# Altium schematic sheet RF.SchDoc
size A
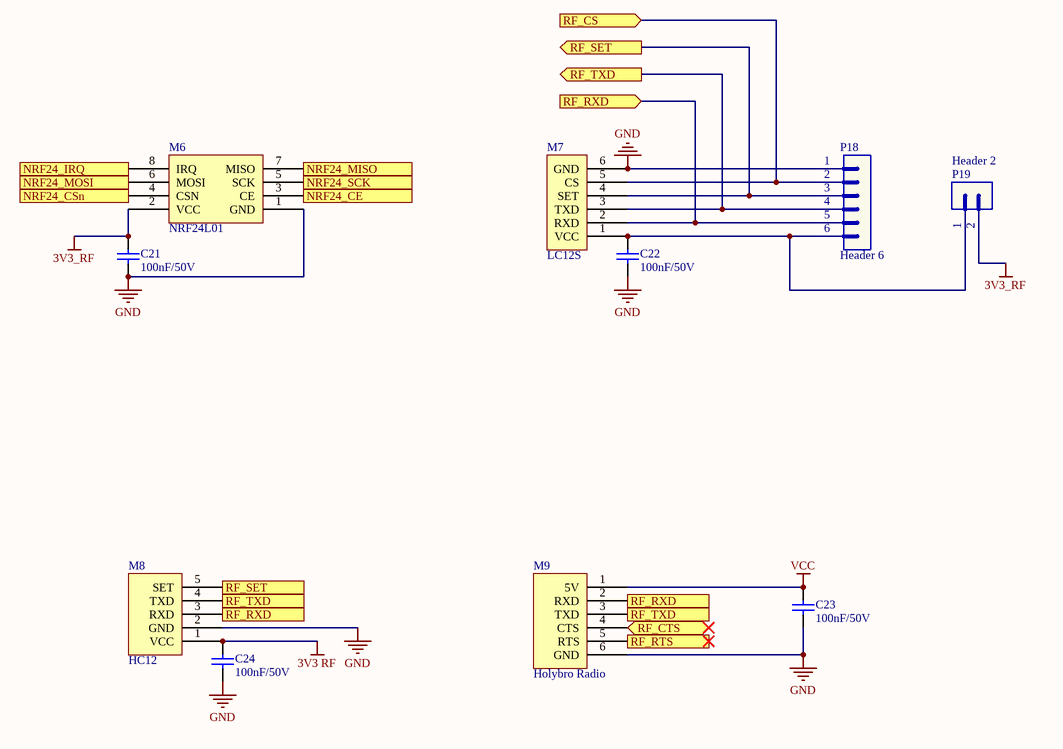
[diagram p0: RF.SchDoc]

## Parts
C21  value 100nF/50V  [CAP-SM-0805]  (hidden comment: Cap-100nF-50V-0805)
C22  value 100nF/50V  [CAP-SM-0805]  (hidden comment: Cap-100nF-50V-0805)
C23  value 100nF/50V  [CAP-SM-0805]  (hidden comment: Cap-100nF-50V-0805)
C24  value 100nF/50V  [CAP-SM-0805]  (hidden comment: Cap-100nF-50V-0805)
M6  NRF24L01  [NRF24L01]
M7  LC12S  [LC12S]
M8  HC12  [HC12]
M9  Holybro Radio  [HOLYBRO RADIO]
P18  Header 6  [JP6]
P19  Header 2  [JP2]

## Ports
NRF24_CE (in), NRF24_CSn (in), NRF24_IRQ (out), NRF24_MISO (out), NRF24_MOSI (in), NRF24_SCK (in), RF_CS (in), RF_CTS (bidir), RF_RTS, RF_RXD (in), RF_RXD (out), RF_SET (out), RF_TXD (in), RF_TXD (out)

## Nets
3V3 RF: C24.2 M8.1(VCC)
3V3_RF: C21.2 M6.2(VCC) P19.2
GND: C21.1 C22.1 C23.1 C24.1 M6.1(GND) M7.6(GND) M8.2(GND) M9.6(GND) P18.1
VCC: C23.2 M9.1(5V)
NRF24_CE: M6.3(CE) ; port NRF24_CE
NRF24_CSn: M6.4(CSN) ; port NRF24_CSn
NRF24_IRQ: M6.8(IRQ) ; port NRF24_IRQ
NRF24_MISO: M6.7(MISO) ; port NRF24_MISO
NRF24_MOSI: M6.6(MOSI) ; port NRF24_MOSI
NRF24_SCK: M6.5(SCK) ; port NRF24_SCK
RF_CS: M7.5(CS) P18.2 ; port RF_CS
RF_CTS: M9.4(CTS) ; port RF_CTS
RF_RTS: M9.5(RTS) ; port RF_RTS
RF_RXD: M7.2(RXD) M8.3(RXD) M9.2(RXD) P18.5 ; port RF_RXD
RF_SET: M7.4(SET) M8.5(SET) P18.3 ; port RF_SET
RF_TXD: M7.3(TXD) M8.4(TXD) M9.3(TXD) P18.4 ; port RF_TXD
NetC22_2: C22.2 M7.1(VCC) P18.6 P19.1

## Library data of the parts
C21-C24 = Cap-100nF-50V-0805: CAP CER 0.1UF 50V Y5V 0805; Manufacturer: Samsung Electro-Mechanics; Manufacturer Part Number: CL21F104ZBCNNNC; Local Supplier: thegioiic; Local Supplier Link: https://thegioiic.com/products/tu-100nf-0-1uf-50v-0805; Supplier 1: Digikey; Supplier 1 Part Number: 1276-1007-1-ND; Supplier 1 Link: https://www.digikey.com/product-detail/en/samsung-electro-mechanics/CL21F104ZBCNNNC/1276-1007-1-ND/3889093
P18 = Header 6: Header, 6-Pin; LatestRevisionDate: 17-Jul-2002; LatestRevisionNote: Re-released for DXP Platform.; Publisher: Altium Limited
P19 = Header 2: Header, 2-Pin; LatestRevisionDate: 17-Jul-2002; LatestRevisionNote: Re-released for DXP Platform.; Publisher: Altium Limited
M6 = NRF24L01: Local Supplier Link: https://hshop.vn/products/mach-thu-phat-nrf24l01-pa-2-4ghzcu-khech-dai-cung-suat-thu-phat; Local Supplier Part Number: HS000888; Manufacturer: *; Manufacturer Part Number: *; Local Supplier: HShop
M7 = LC12S: Local Supplier: HShop; Local Supplier Link: https://hshop.vn/products/mach-thu-phat-rf-uart-lc12s-2-4ghz; Local Supplier Part Number: HS000895; Manufacturer: *; Manufacturer Part Number: *
M8 = HC12: Local Supplier Link: https://hshop.vn/products/mach-thu-phat-rf-uart-si4463-433mhzkhoang-coch-1km; Local Supplier Part Number: HS000897; Manufacturer: *; Manufactuer Part Number: *; Local Supplier: HShop
M9 = HOLYBRO RADIO: Supploer Part Number: *; Supplier: *; Supploer Link: https://www.lazada.vn/products/ld-holybro-433mhz-915-mhz-500-mw-thu-phat-vo-tuyen-xa-bo-v3-cho-pixhawk-4-dieu-khien-chuyen-bay-i430804435-s768474304.html?spm=a2o4n.searchlist.list.4.25396b19yIS9XO&search=1; Manufacturer Part Number: *; Manufacturer: *